# Altium schematic sheet Sheet1 - Pic.SchDoc: Carte Balise Triangulation -PRJM1E11
size A4; DrawnBy: PRJM1E11; DocumentNumber: 1; Revision: V1.2; SheetNumber: 1; SheetTotal: 4; VersionControl_RevNumber: 1.2; ProjectName: Balise de Triangulation; Rule: PcbType=ProtelPcb
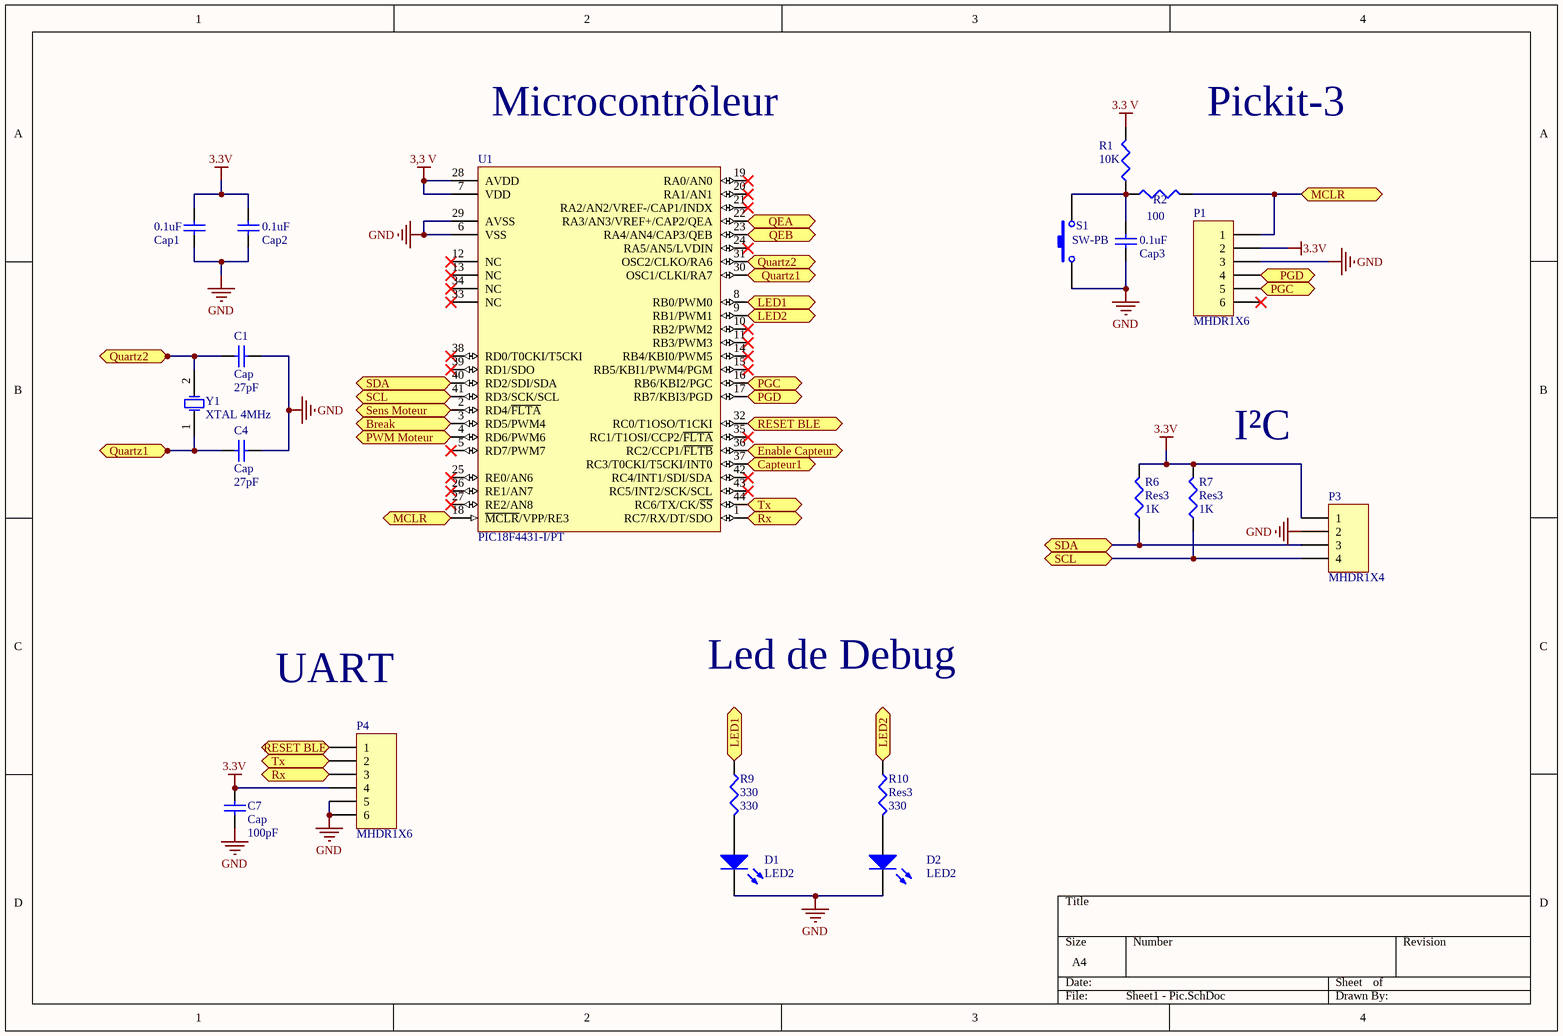
[diagram p0: Sheet1 - Pic.SchDoc]

## Parts
C1  Cap  value 27pF  [RAD-0.3]
C4  Cap  value 27pF  [RAD-0.3]
C7  Cap  value 100pF  [RAD-0.3]
Cap1  0.1uF  [RAD-0.3]
Cap2  0.1uF  [RAD-0.3]
Cap3  0.1uF  [RAD-0.3]
D1  LED2  [DSO-F2/D6.1]
D2  LED2  [DSO-F2/D6.1]
P1  MHDR1X6  [MHDR1X6]
P3  MHDR1X4  [MHDR1X4]
P4  MHDR1X6  [MHDR1X6]
R1  value 10K  [RESC1608L]  (hidden comment: Res3)
R2  R1: 100  [RESC1608L]
R6  Res3  value 1K  [RESC1608L]
R7  Res3  value 1K  [RESC1608L]
R9  330  [RESC1608L]
R10  Res3  value 330  [RESC1608L]
S1  SW-PB  [SPST-2]
U1  PIC18F4431-I/PT  [TQFP-PT44_L]
Y1  XTAL 4MHz  [BCY-W2/D3.1]

## Ports
Break, Capteur1 (bidir), Enable Capteur, LED1 (bidir), LED2 (bidir), MCLR (bidir), PGC (bidir), PGD (bidir), PWM Moteur (bidir), QEA (bidir), QEB (bidir), Quartz1, Quartz1 (bidir), Quartz2, Quartz2 (bidir), RESET BLE (bidir), Rx (bidir), SCL (bidir), SDA (bidir), Sens Moteur (bidir), Tx (bidir)

## Nets
3,3 V: U1.7(VDD) U1.28(AVDD)
3.3 V: R1.2
3.3V: C7.2 Cap1.2 Cap2.2 P1.2 P3.1 P4.4 R6.2 R7.2
GND: C1.1 C4.1 C7.1 Cap1.1 Cap2.1 Cap3.1 D1.2(K) D2.2(K) P1.3 P3.2 P4.5 P4.6 S1.1 U1.6(VSS) U1.29(AVSS)
Break: U1.3(RD5/PWM4) ; port Break
Capteur1: U1.37(RC3/T0CKI/T5CKI/INT0) ; port Capteur1
Enable Capteur: U1.36(RC2/CCP1/~{FLTB}) ; port Enable Capteur
LED1: R9.1 U1.8(RB0/PWM0) ; port LED1
LED2: R10.1 U1.9(RB1/PWM1) ; port LED2
MCLR: P1.1 R2.2 U1.18(~{MCLR}/VPP/RE3) ; port MCLR
PGC: P1.5 U1.16(RB6/KBI2/PGC) ; port PGC
PGD: P1.4 U1.17(RB7/KBI3/PGD) ; port PGD
PWM Moteur: U1.4(RD6/PWM6) ; port PWM Moteur
QEA: U1.22(RA3/AN3/VREF+/CAP2/QEA) ; port QEA
QEB: U1.23(RA4/AN4/CAP3/QEB) ; port QEB
Quartz1: C4.2 U1.30(OSC1/CLKI/RA7) Y1.1(OSC1) ; port Quartz1
Quartz2: C1.2 U1.31(OSC2/CLKO/RA6) Y1.2(OSC2) ; port Quartz2
RESET BLE: P4.1 U1.32(RC0/T1OSO/T1CKI) ; port RESET BLE
Rx: P4.3 U1.1(RC7/RX/DT/SDO) ; port Rx
SCL: P3.4 R7.1 U1.41(RD3/SCK/SCL) ; port SCL
SDA: P3.3 R6.1 U1.40(RD2/SDI/SDA) ; port SDA
Sens Moteur: U1.2(RD4/~{FLTA}) ; port Sens Moteur
Tx: P4.2 U1.44(RC6/TX/CK/~{SS}) ; port Tx
NetCap3_2: Cap3.2 R1.1 R2.1 S1.2
NetD1_1: D1.1(A) R9.2
NetD2_1: D2.1(A) R10.2

Not connected (* = marked no-connect by the designer): P1 6*; U1 5(RD7/PWM7)* 10(RB2/PWM2)* 11(RB3/PWM3)* 12(NC)* 13(NC)* 14(RB4/KBI0/PWM5)* 15(RB5/KBI1/PWM4/PGM)* 19(RA0/AN0)* 20(RA1/AN1)* 21(RA2/AN2/VREF-/CAP1/INDX)* 24(RA5/AN5/LVDIN)* 25(RE0/AN6)* 26(RE1/AN7)* 27(RE2/AN8)* 33(NC)* 34(NC)* 35(RC1/T1OSI/CCP2/~{FLTA})* 38(RD0/T0CKI/T5CKI)* 39(RD1/SDO)* 42(RC4/INT1/SDI/SDA)* 43(RC5/INT2/SCK/SCL)*

## Notes on the sheet
- Microcontrôleur
- Pickit-3
- I²C
- UART
- Led de Debug

## Library data of the parts
C1 C4 C7 Cap1-Cap3 = Cap: Capacitor; Published: 8-Jun-2000; LatestRevisionDate: 17-Jul-2002; LatestRevisionNote: Re-released for DXP Platform.; PackageReference: RAD-0.3; Publisher: Altium Limited
  Cap3: value: 0.1uF
D1 D2 = LED2: Typical RED, GREEN, YELLOW, AMBER GaAs LED; Published: 8-Jun-2000; LatestRevisionDate: 17-Jul-2002; LatestRevisionNote: Re-released for DXP Platform.; PackageVersion: Feb-2002; PackageReference: 3.2X1.6X1.1; Publisher: Altium Limited
P1 P4 = MHDR1X6: Header, 6-Pin; LatestRevisionDate: 17-Jul-2002; LatestRevisionNote: Re-released for DXP Platform.; Publisher: Altium Limited
P3 = MHDR1X4: Header, 4-Pin; LatestRevisionDate: 17-Jul-2002; LatestRevisionNote: Re-released for DXP Platform.; Publisher: Altium Limited
R1 R2 R6 R7 R9 R10 = Res3: Resistor; Published: 8-Jun-2000; LatestRevisionDate: 29-May-2009; LatestRevisionNote: IPC-7351 Footprint Added.; PackageReference: J1-0603; Publisher: Altium Limited; PackageDescription: Chip Resistor
  R9: Value: 330
S1 = SW-PB: Switch; Published: 24-Mar-1999; LatestRevisionDate: 17-Jul-2002; LatestRevisionNote: Re-released for DXP Platform.; PackageReference: SPST-2; Publisher: Altium Limited
U1 = PIC18F4431-I/PT: Enhanced Flash Microcontroller with nanoWatt Technology, High Performance PWM and A/D, 16K Flash, 44-Pin TQFP, Industrial Temperature; FirstPublished: 11-Oct-2004; LatestRevisionDate: 29-Jan-2009; LatestRevisionNote: Sch. layout revised. 3D Model Removed.; DatasheetVersion: revC, Jul-2007; PackageVersion: revBB, Aug-2009; PackageReference: TQFP-PT44; Publisher: Altium Limited; PackageDescription: 44-Lead Plastic Thin Quad Flatpack (PT) - 10x10x1mm Body, 2.00mm [TQFP]; Supplier 1: Digi-Key; Supplier Part Number 1: PIC18F4431-I/PT-ND; Supplier 2: Farnell; Supplier Part Number 2: 1137346; Supplier 3: Farnell; Supplier Part Number 3: 1137420; Supplier 4: Farnell; Supplier Part Number 4: 1528308; Supplier 5: Newark; Supplier Part Number 5: 61K3473; Code_JEDEC: MS-026; ComponentLink1Description: Datasheet; ComponentLink1URL: http://ww1.microchip.com/downloads/en/DeviceDoc/39616C.pdf; ComponentLink2Description: Packaging Specification; ComponentLink2URL: http://www.microchip.com/stellent/groups/techpub_sg/documents/packagingspec/en012702.pdf; ComponentLink3Description: Microchip.com Home; ComponentLink3URL: http://www.microchip.com/
Y1 = XTAL: Crystal Oscillator; Published: 8-Jun-2000; LatestRevisionDate: 17-Jul-2002; LatestRevisionNote: Re-released for DXP Platform.; PackageReference: R38; Publisher: Altium Limited